# EAGLE design Patch_Panel (EAGLE 6.5.0)
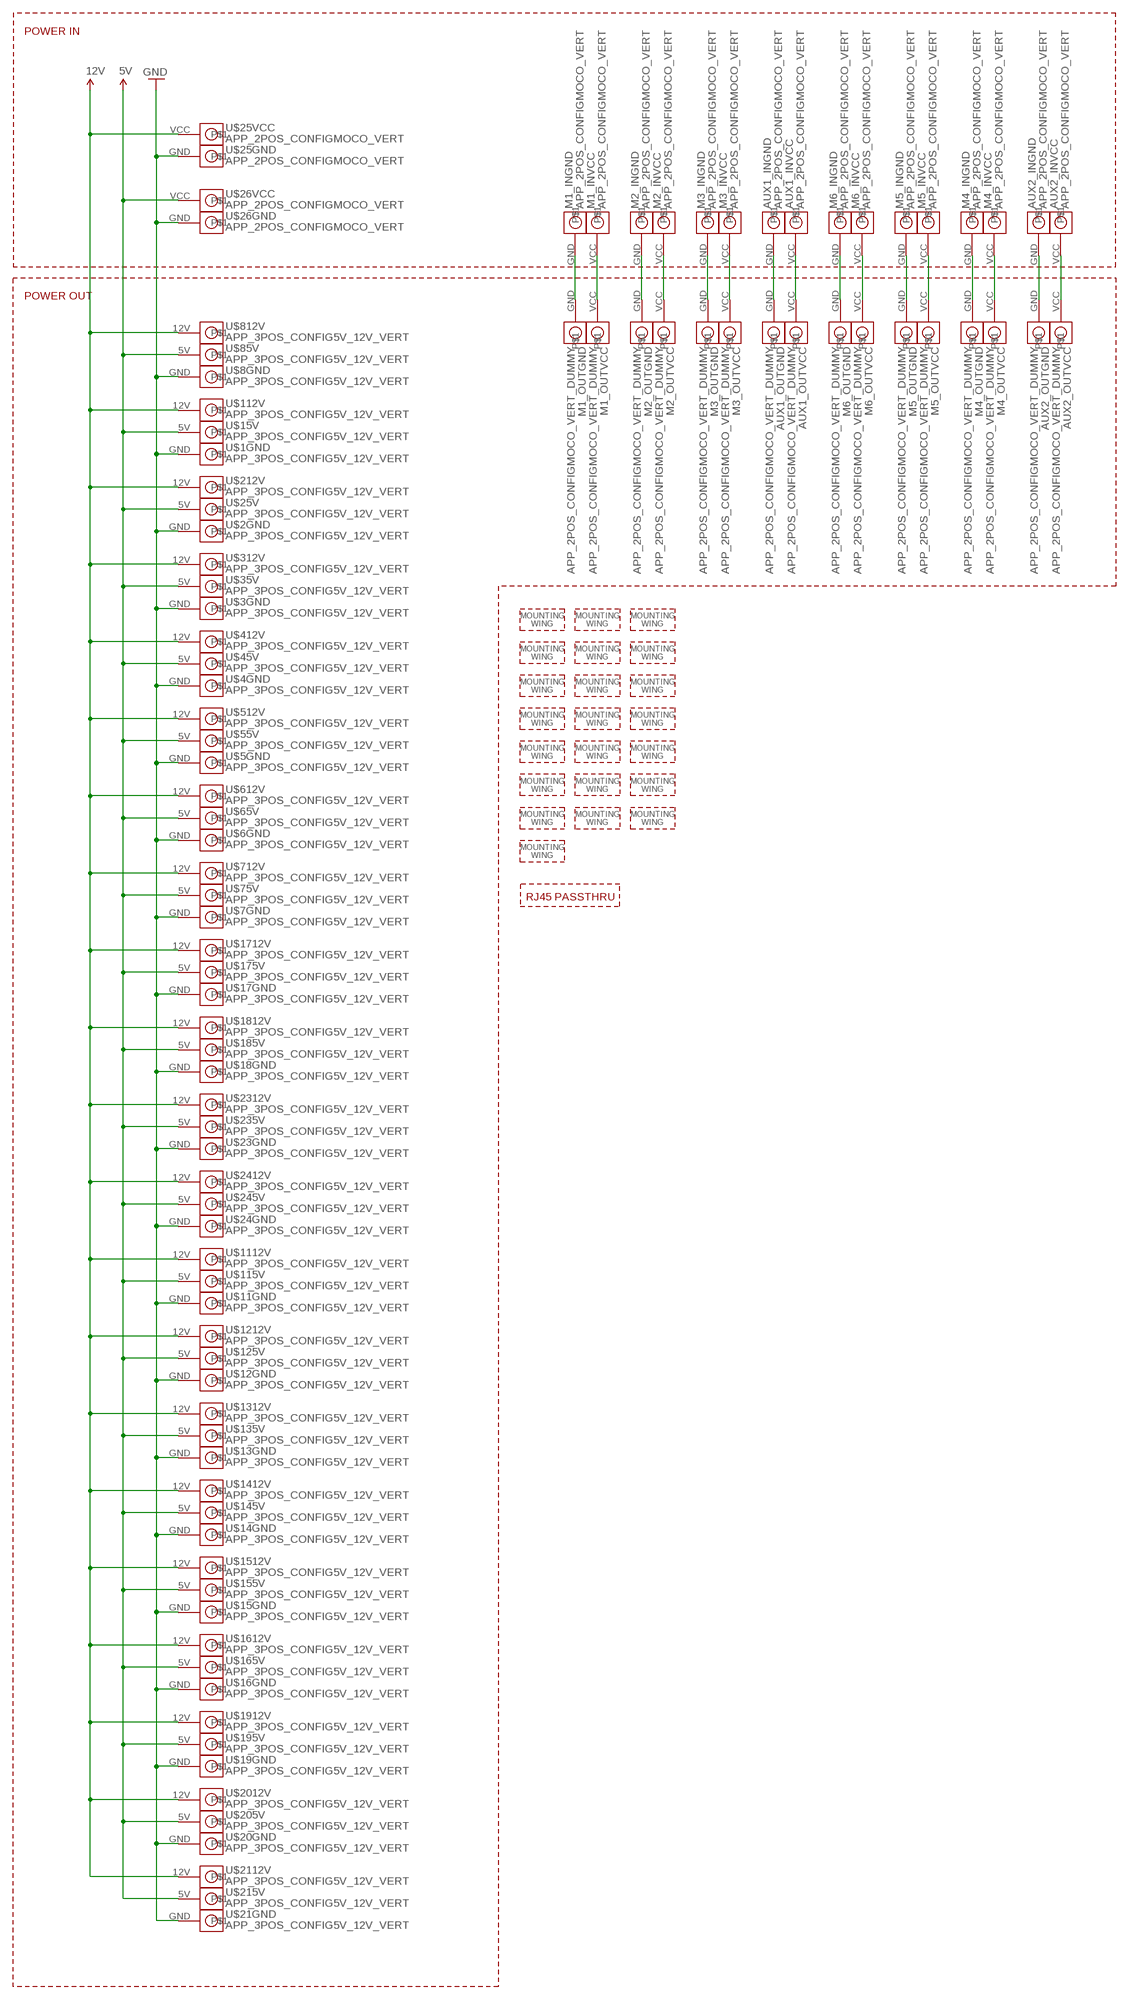
[diagram p0: schematic, sheet 1]

## Parts
AUX1_IN  APP_2POS_CONFIGMOCO_VERT  [APP45_MOCO_VERT_CONFIG]
AUX1_OUT  APP_2POS_CONFIGMOCO_VERT_DUMMY  [APP45_MOCO_VERT_CONFIG_DUMMY]
AUX2_IN  APP_2POS_CONFIGMOCO_VERT  [APP45_MOCO_VERT_CONFIG]
AUX2_OUT  APP_2POS_CONFIGMOCO_VERT_DUMMY  [APP45_MOCO_VERT_CONFIG_DUMMY]
M1_IN  APP_2POS_CONFIGMOCO_VERT  [APP45_MOCO_VERT_CONFIG]
M1_OUT  APP_2POS_CONFIGMOCO_VERT_DUMMY  [APP45_MOCO_VERT_CONFIG_DUMMY]
M2_IN  APP_2POS_CONFIGMOCO_VERT  [APP45_MOCO_VERT_CONFIG]
M2_OUT  APP_2POS_CONFIGMOCO_VERT_DUMMY  [APP45_MOCO_VERT_CONFIG_DUMMY]
M3_IN  APP_2POS_CONFIGMOCO_VERT  [APP45_MOCO_VERT_CONFIG]
M3_OUT  APP_2POS_CONFIGMOCO_VERT_DUMMY  [APP45_MOCO_VERT_CONFIG_DUMMY]
M4_IN  APP_2POS_CONFIGMOCO_VERT  [APP45_MOCO_VERT_CONFIG]
M4_OUT  APP_2POS_CONFIGMOCO_VERT_DUMMY  [APP45_MOCO_VERT_CONFIG_DUMMY]
M5_IN  APP_2POS_CONFIGMOCO_VERT  [APP45_MOCO_VERT_CONFIG]
M5_OUT  APP_2POS_CONFIGMOCO_VERT_DUMMY  [APP45_MOCO_VERT_CONFIG_DUMMY]
M6_IN  APP_2POS_CONFIGMOCO_VERT  [APP45_MOCO_VERT_CONFIG]
M6_OUT  APP_2POS_CONFIGMOCO_VERT_DUMMY  [APP45_MOCO_VERT_CONFIG_DUMMY]
U$1  APP_3POS_CONFIG5V_12V_VERT  [APP45_5V_12V_VERT_CONFIG]
U$2  APP_3POS_CONFIG5V_12V_VERT  [APP45_5V_12V_VERT_CONFIG]
U$3  APP_3POS_CONFIG5V_12V_VERT  [APP45_5V_12V_VERT_CONFIG]
U$4  APP_3POS_CONFIG5V_12V_VERT  [APP45_5V_12V_VERT_CONFIG]
U$5  APP_3POS_CONFIG5V_12V_VERT  [APP45_5V_12V_VERT_CONFIG]
U$6  APP_3POS_CONFIG5V_12V_VERT  [APP45_5V_12V_VERT_CONFIG]
U$7  APP_3POS_CONFIG5V_12V_VERT  [APP45_5V_12V_VERT_CONFIG]
U$8  APP_3POS_CONFIG5V_12V_VERT  [APP45_5V_12V_VERT_CONFIG]
U$9  APP_MOUTING_WINGVERT  [APP45_MOUNTING_WING_VERT]
U$10  APP_MOUTING_WINGVERT  [APP45_MOUNTING_WING_VERT]
U$11  APP_3POS_CONFIG5V_12V_VERT  [APP45_5V_12V_VERT_CONFIG]
U$12  APP_3POS_CONFIG5V_12V_VERT  [APP45_5V_12V_VERT_CONFIG]
U$13  APP_3POS_CONFIG5V_12V_VERT  [APP45_5V_12V_VERT_CONFIG]
U$14  APP_3POS_CONFIG5V_12V_VERT  [APP45_5V_12V_VERT_CONFIG]
U$15  APP_3POS_CONFIG5V_12V_VERT  [APP45_5V_12V_VERT_CONFIG]
U$16  APP_3POS_CONFIG5V_12V_VERT  [APP45_5V_12V_VERT_CONFIG]
U$17  APP_3POS_CONFIG5V_12V_VERT  [APP45_5V_12V_VERT_CONFIG]
U$18  APP_3POS_CONFIG5V_12V_VERT  [APP45_5V_12V_VERT_CONFIG]
U$19  APP_3POS_CONFIG5V_12V_VERT  [APP45_5V_12V_VERT_CONFIG]
U$20  APP_3POS_CONFIG5V_12V_VERT  [APP45_5V_12V_VERT_CONFIG]
U$21  APP_3POS_CONFIG5V_12V_VERT  [APP45_5V_12V_VERT_CONFIG]
U$22  APP_MOUTING_WINGVERT  [APP45_MOUNTING_WING_VERT]
U$23  APP_3POS_CONFIG5V_12V_VERT  [APP45_5V_12V_VERT_CONFIG]
U$24  APP_3POS_CONFIG5V_12V_VERT  [APP45_5V_12V_VERT_CONFIG]
U$25  APP_2POS_CONFIGMOCO_VERT  [APP45_MOCO_VERT_CONFIG]
U$26  APP_2POS_CONFIGMOCO_VERT  [APP45_MOCO_VERT_CONFIG]
U$27  APP_MOUTING_WINGVERT  [APP45_MOUNTING_WING_VERT]
U$28  APP_MOUTING_WINGVERT  [APP45_MOUNTING_WING_VERT]
U$29  APP_MOUTING_WINGVERT  [APP45_MOUNTING_WING_VERT]
U$30  APP_MOUTING_WINGVERT  [APP45_MOUNTING_WING_VERT]
U$31  APP_MOUTING_WINGVERT  [APP45_MOUNTING_WING_VERT]
U$32  APP_MOUTING_WINGVERT  [APP45_MOUNTING_WING_VERT]
U$33  APP_MOUTING_WINGVERT  [APP45_MOUNTING_WING_VERT]
U$34  APP_MOUTING_WINGVERT  [APP45_MOUNTING_WING_VERT]
U$35  APP_MOUTING_WINGVERT  [APP45_MOUNTING_WING_VERT]
U$36  APP_MOUTING_WINGVERT  [APP45_MOUNTING_WING_VERT]
U$37  APP_MOUTING_WINGVERT  [APP45_MOUNTING_WING_VERT]
U$38  APP_MOUTING_WINGVERT  [APP45_MOUNTING_WING_VERT]
U$39  APP_MOUTING_WINGVERT  [APP45_MOUNTING_WING_VERT]
U$40  APP_MOUTING_WINGVERT  [APP45_MOUNTING_WING_VERT]
U$41  APP_MOUTING_WINGVERT  [APP45_MOUNTING_WING_VERT]
U$42  APP_MOUTING_WINGVERT  [APP45_MOUNTING_WING_VERT]
U$43  APP_MOUTING_WINGVERT  [APP45_MOUNTING_WING_VERT]
U$44  APP_MOUTING_WINGVERT  [APP45_MOUNTING_WING_VERT]
U$45  APP_MOUTING_WINGVERT  [APP45_MOUNTING_WING_VERT]
U$46  RJ45_PASSTHRUMRDT_MALE_RJ45_STANDOFF  [MRDT_MALE_RJ45_STANDOFF]

## Nets
5V: U$1.5V U$2.5V U$3.5V U$4.5V U$5.5V U$6.5V U$7.5V U$8.5V U$11.5V U$12.5V U$13.5V U$14.5V U$15.5V U$16.5V U$17.5V U$18.5V U$19.5V U$20.5V U$21.5V U$23.5V U$24.5V U$26.VCC
12V: U$1.12V U$2.12V U$3.12V U$4.12V U$5.12V U$6.12V U$7.12V U$8.12V U$11.12V U$12.12V U$13.12V U$14.12V U$15.12V U$16.12V U$17.12V U$18.12V U$19.12V U$20.12V U$21.12V U$23.12V U$24.12V U$25.VCC
AUX1_VCC: AUX1_IN.VCC AUX1_OUT.VCC
AUX2_VCC: AUX2_IN.VCC AUX2_OUT.VCC
GND: AUX1_IN.GND AUX1_OUT.GND AUX2_IN.GND AUX2_OUT.GND M1_IN.GND M1_OUT.GND M2_IN.GND M2_OUT.GND M3_IN.GND M3_OUT.GND M4_IN.GND M4_OUT.GND M5_IN.GND M5_OUT.GND M6_IN.GND M6_OUT.GND U$1.GND U$2.GND U$3.GND U$4.GND U$5.GND U$6.GND U$7.GND U$8.GND U$11.GND U$12.GND U$13.GND U$14.GND U$15.GND U$16.GND U$17.GND U$18.GND U$19.GND U$20.GND U$21.GND U$23.GND U$24.GND U$25.GND U$26.GND
M1_VCC: M1_IN.VCC M1_OUT.VCC
M2_VCC: M2_IN.VCC M2_OUT.VCC
M3_VCC: M3_IN.VCC M3_OUT.VCC
M4_VCC: M4_IN.VCC M4_OUT.VCC
M5_VCC: M5_IN.VCC M5_OUT.VCC
M6_VCC: M6_IN.VCC M6_OUT.VCC

## Notes on the sheet
- POWER IN
- POWER OUT

## Library data of the parts
AUX1_IN AUX1_OUT AUX2_IN AUX2_OUT = MRDT-Connectors:APP_2POS_CONFIG; COLOR1: GREY; COLOR2: BLACK
M1_IN M1_OUT = MRDT-Connectors:APP_2POS_CONFIG; COLOR1: ORANGE; COLOR2: BLACK
M2_IN M2_OUT = MRDT-Connectors:APP_2POS_CONFIG; COLOR1: WHITE; COLOR2: BLACK
M3_IN M3_OUT = MRDT-Connectors:APP_2POS_CONFIG; COLOR1: GREEN; COLOR2: BLACK
M4_IN M4_OUT = MRDT-Connectors:APP_2POS_CONFIG; COLOR1: PINK; COLOR2: BLACK
M5_IN M5_OUT = MRDT-Connectors:APP_2POS_CONFIG; COLOR1: VIOLET; COLOR2: BLACK
M6_IN M6_OUT = MRDT-Connectors:APP_2POS_CONFIG; COLOR1: BLUE; COLOR2: BLACK
U$1-U$8 U$11-U$21 U$23 U$24 = MRDT-Connectors:APP_3POS_CONFIG; COLOR1: YELLOW; COLOR2: RED; COLOR3: BLACK
U$9 U$10 U$22 U$27-U$45 = MRDT-Connectors:APP_MOUTING_WING
U$25 U$26 = MRDT-Connectors:APP_2POS_CONFIG; COLOR2: BLACK
U$46 = MRDT-Connectors:RJ45_PASSTHRU

## Board
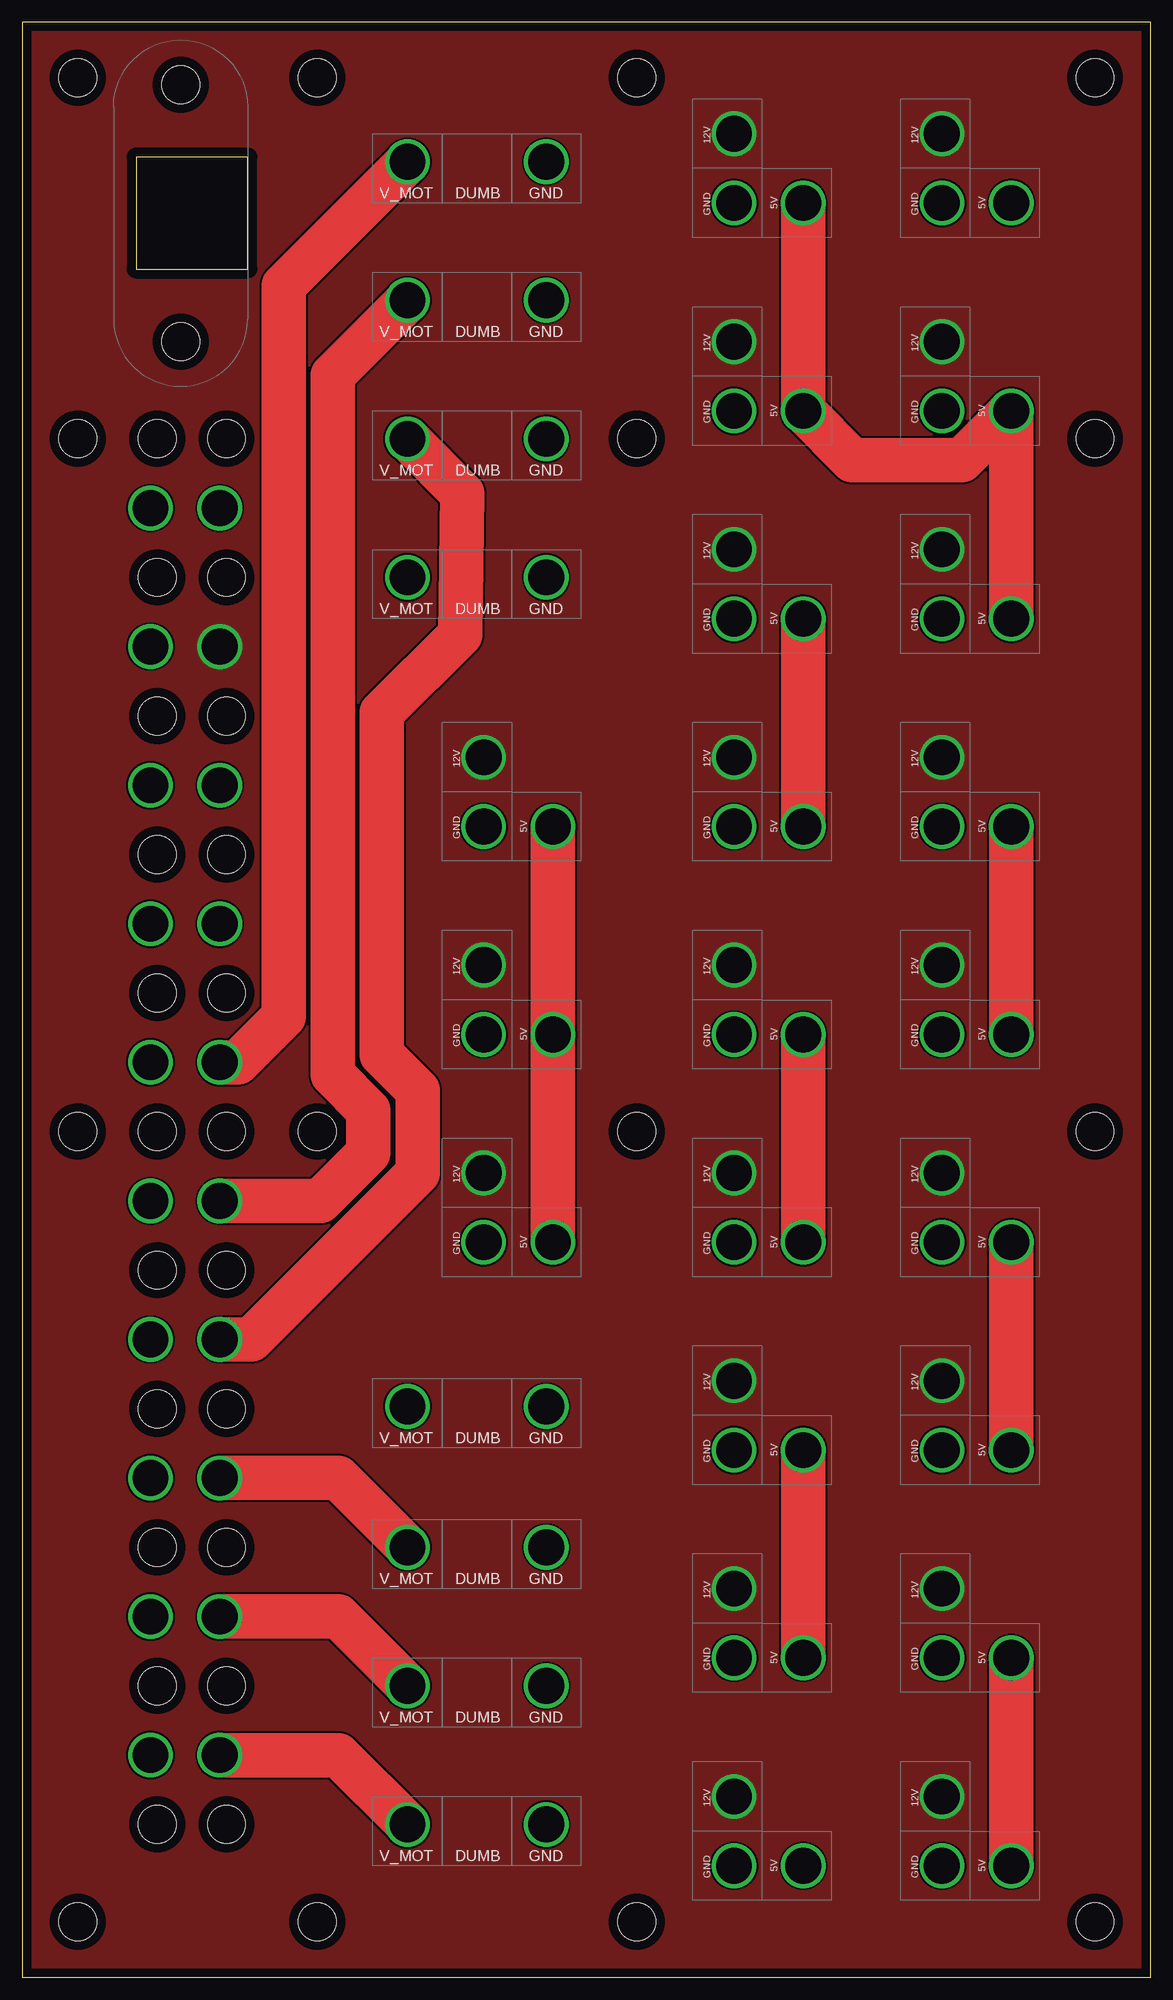
[diagram p1: board, top side]
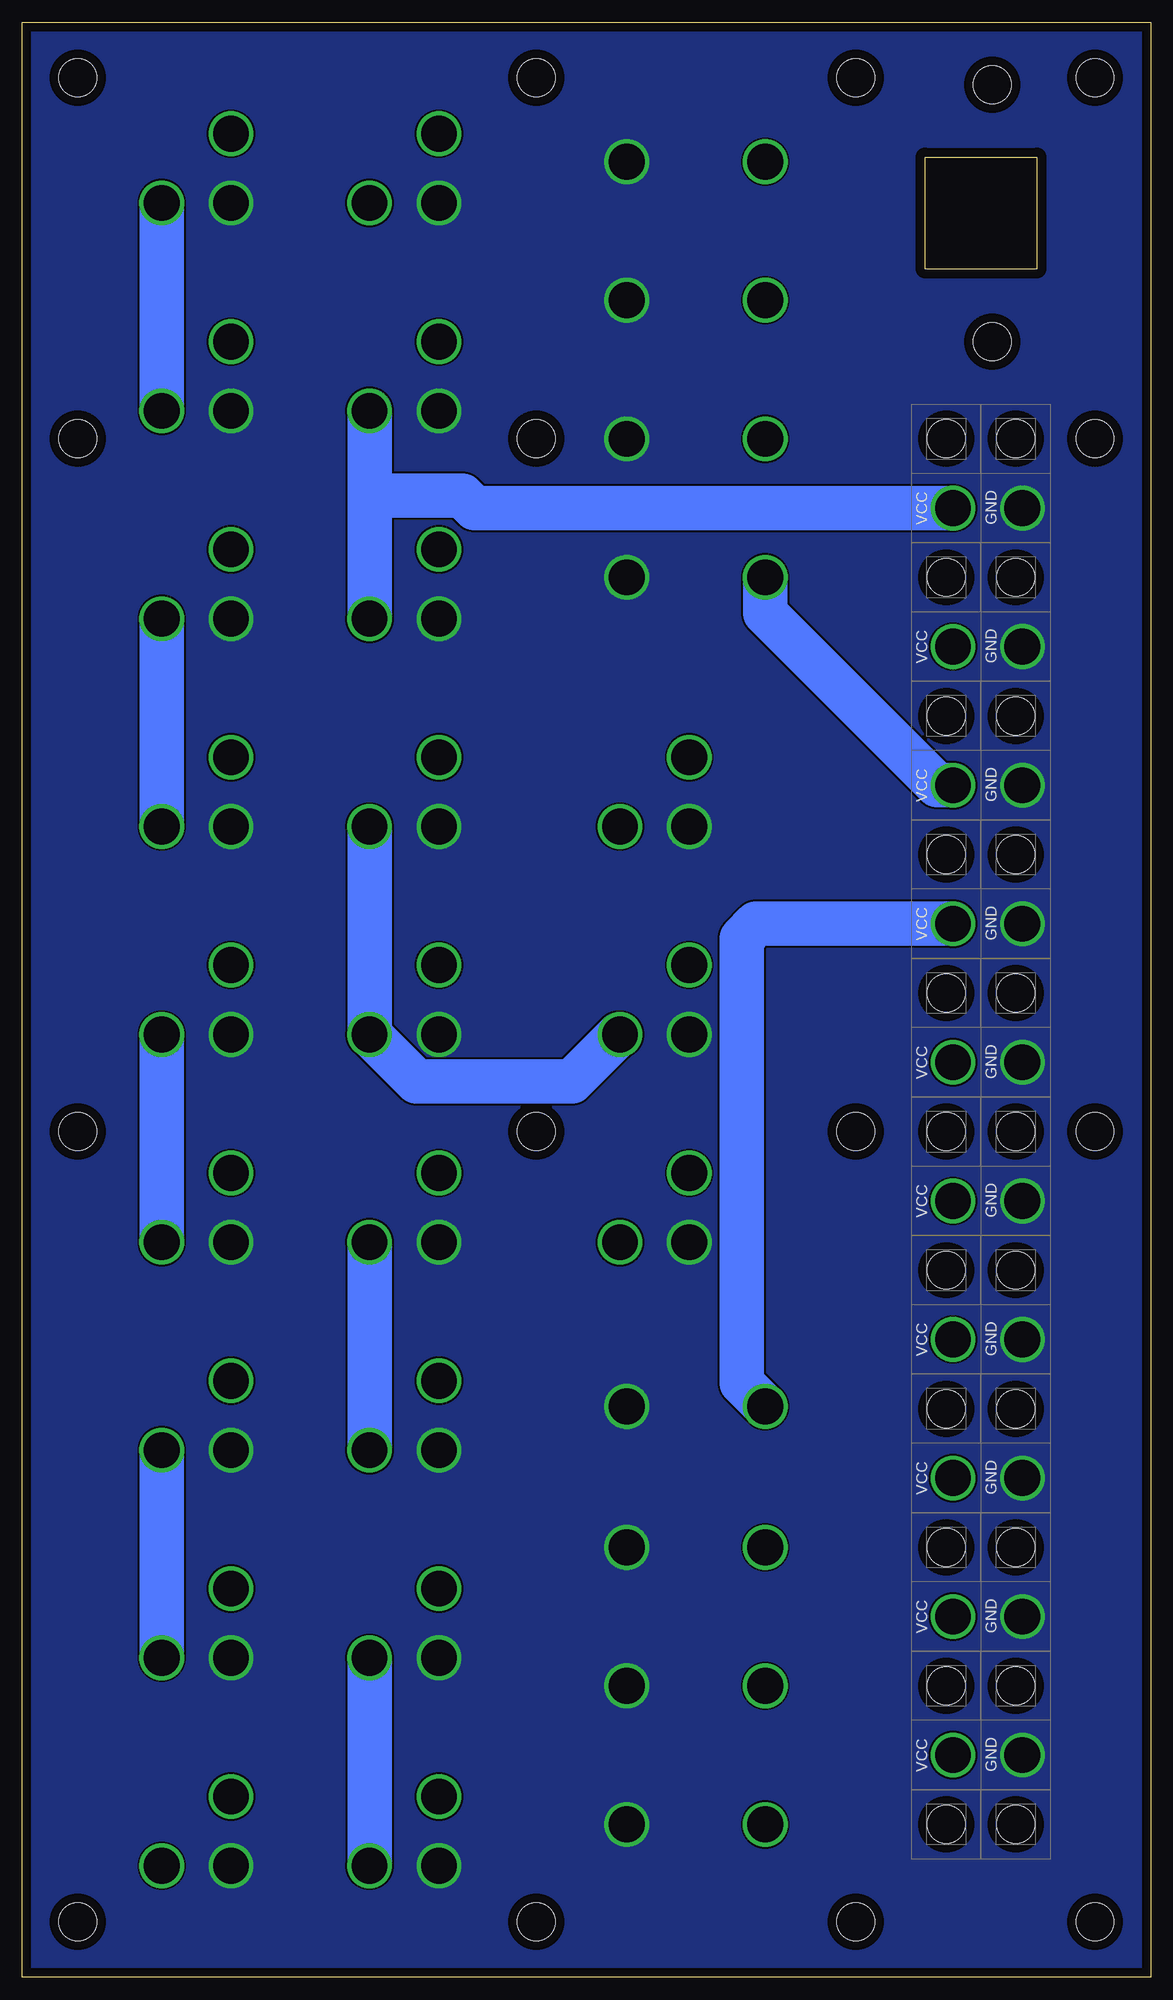
[diagram p2: board, bottom side, seen from below]

Size 128.27 x 222.25 mm. Coordinates in mm from the lower left corner, seen from the top.
Outline: 0,0 128.27,0 128.27,222.25 0,222.25 0,0
Copper layers (1*16): Top 0.035mm / dielectric 1.5mm / Bottom 0.035mm
Design rules "default *": minimum track width 10mil, minimum drill 24mil, track to track 8mil, track to pad 8mil, pad to pad 8mil, via to via 8mil, smd to smd 8mil, copper to edge 40mil, drill to drill 8mil, minimum pad ring 10mil, minimum via ring 8mil, stop-mask expansion 4mil, vias tented up to drill 0mil, thermal gap 10mil
Holes 4.32 mm at 6.35,215.9 69.85,96.14 6.35,96.14 69.85,6.35 6.35,6.35 121.92,215.9 121.92,96.14 121.92,174.88 69.85,174.88 121.92,6.35 69.85,215.9 33.53,96.14 33.53,6.35 33.53,215.9 6.35,174.88

### Footprints (pad centres in the part's own frame; a part is rotated, then mirrored left to right if it is on the bottom)
APP45_MOCO_VERT_CONFIG = drill 4.064: GND 3.937,3.175; VCC 3.937,11.049
APP45_MOCO_VERT_CONFIG_DUMMY = drill 4.064: GND 3.937,3.175; VCC 19.685,3.175
APP45_5V_12V_VERT_CONFIG = drill 4.064: 5V 12.573,3.937; 12V 4.699,11.811; GND 4.699,3.937
APP45_MOUNTING_WING_VERT = hole 4.318: 3.937,3.937
MRDT_MALE_RJ45_STANDOFF = hole 4.318: -2.54,7.62; 26.67,7.62

### Placement (x,y rotation side)
AUX1_IN  11.43,115.82 90 bottom
AUX1_OUT  63.5,68.07 180 top
AUX2_IN  11.43,131.57 90 bottom
AUX2_OUT  63.5,162.31 180 top
M1_IN  11.43,21.34 90 bottom
M1_OUT  63.5,20.57 180 top
M2_IN  11.43,37.08 90 bottom
M2_OUT  63.5,36.32 180 top
M3_IN  11.43,52.83 90 bottom
M3_OUT  63.5,52.07 180 top
M4_IN  11.43,68.58 90 bottom
M4_OUT  63.5,178.05 180 top
M5_IN  11.43,84.33 90 bottom
M5_OUT  63.5,193.8 180 top
M6_IN  11.43,100.08 90 bottom
M6_OUT  63.5,209.55 180 top
U$1  76.2,126.87 0 top
U$2  99.82,103.25 0 top
U$3  76.2,103.25 0 top
U$4  99.82,56.01 0 top
U$5  76.2,79.63 0 top
U$6  99.82,32.38 0 top
U$7  76.2,56.01 0 top
U$8  99.82,126.87 0 top
U$9  11.43,13.46 90 bottom
U$10  11.43,123.7 90 bottom
U$11  47.75,79.63 0 top
U$12  76.2,197.74 0 top
U$13  76.2,174.12 0 top
U$14  47.75,126.87 0 top
U$15  76.2,150.5 0 top
U$16  47.75,103.25 0 top
U$17  76.2,32.38 0 top
U$18  99.82,8.76 0 top
U$19  99.82,150.5 0 top
U$20  99.82,174.12 0 top
U$21  99.82,197.74 0 top
U$22  11.43,29.21 90 bottom
U$23  99.82,79.63 0 top
U$24  76.2,8.76 0 top
U$25  11.43,147.32 90 bottom
U$26  11.43,163.07 90 bottom
U$27  19.3,123.7 90 bottom
U$28  19.3,92.2 90 bottom
U$29  11.43,44.96 90 bottom
U$30  11.43,60.71 90 bottom
U$31  19.3,37.08 180 bottom
U$32  11.43,76.45 90 bottom
U$33  11.43,92.2 90 bottom
U$34  11.43,107.95 90 bottom
U$35  19.3,76.45 90 bottom
U$36  19.3,60.71 90 bottom
U$37  19.3,44.96 90 bottom
U$38  11.43,155.19 90 bottom
U$39  19.3,13.46 90 bottom
U$40  11.43,170.94 90 bottom
U$41  11.43,139.45 90 bottom
U$42  19.3,170.94 90 bottom
U$43  19.3,155.19 90 bottom
U$44  19.3,107.95 90 bottom
U$45  19.3,139.45 90 bottom
U$46  10.41,212.6 270 top

### Tracks (layer width: path | path; a pad name or v marks a point on that pad's centre or on a via)
5V
  Top 5.08: U$12.5V U$13.5V 94.36,172.47 106.81,172.47 U$20.5V U$19.5V | U$15.5V U$1.5V | U$8.5V U$2.5V | U$3.5V U$5.5V | U$23.5V U$4.5V | U$7.5V U$17.5V | U$6.5V U$18.5V | U$14.5V U$16.5V U$11.5V
  Bottom 5.08: U$21.5V U$20.5V | U$13.5V 88.77,168.4 | 88.77,168.4 U$15.5V | U$19.5V U$8.5V | U$1.5V U$3.5V 83.44,101.85 65.79,101.85 60.45,107.19 U$16.5V | U$2.5V U$23.5V | U$5.5V U$7.5V | U$4.5V U$6.5V | U$17.5V U$24.5V | U$26.VCC 76.83,167 78.23,168.4 88.77,168.4
12V
  pour Top: -10.16,239.78 -10.16,-10.16 141.99,-11.18 141.99,238.76
AUX1_VCC
  Bottom 5.08: AUX1_IN.VCC 44.83,119.76 46.48,118.11 46.48,67.56 AUX1_OUT.VCC
AUX2_VCC
  Bottom 5.08: AUX2_IN.VCC 24.26,135.51 43.81,155.07 AUX2_OUT.VCC
GND
  pour Bottom: -5.59,247.9 -5.08,-5.08 151.38,-5.08 150.88,247.9
M1_VCC
  Top 5.08: M1_IN.VCC 35.94,25.27 M1_OUT.VCC
M2_VCC
  Top 5.08: M2_IN.VCC 35.94,41.02 M2_OUT.VCC
M3_VCC
  Top 5.08: M3_IN.VCC 35.94,56.77 M3_OUT.VCC
M4_VCC
  Top 5.08: M4_OUT.VCC 50.04,168.66 49.78,152.65 40.89,143.76 40.89,104.9 44.96,100.84 44.96,91.44 26.04,72.52 M4_IN.VCC
M5_VCC
  Top 5.08: M5_OUT.VCC 35.31,182.12 35.31,102.62 39.37,98.55 39.37,93.73 33.91,88.27 M5_IN.VCC
M6_VCC
  Top 5.08: M6_IN.VCC 24.51,104.01 29.72,109.22 29.72,192.28 M6_OUT.VCC